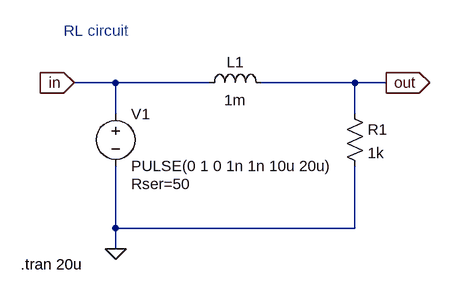
[diagram p0: schematic RL_circuit.asc]
RL_circuit.asc, the LTspice schematic file:
Version 4
SHEET 1 880 680
WIRE 64 96 0 96
WIRE 208 96 64 96
WIRE 432 96 288 96
WIRE 480 96 432 96
WIRE 64 144 64 96
WIRE 432 144 432 96
WIRE 64 320 64 224
WIRE 432 320 432 224
WIRE 432 320 64 320
WIRE 64 352 64 320
FLAG 0 96 in
IOPIN 0 96 In
FLAG 480 96 out
IOPIN 480 96 Out
FLAG 64 352 0
SYMBOL voltage 64 128 R0
WINDOW 123 0 0 Left 2
WINDOW 39 24 124 Left 2
SYMATTR InstName V1
SYMATTR Value PULSE(0 1 0 1n 1n 10u 20u)
SYMATTR SpiceLine Rser=50
SYMBOL ind 192 112 R270
WINDOW 0 32 56 VTop 2
WINDOW 3 5 56 VBottom 2
SYMATTR InstName L1
SYMATTR Value 1m
SYMBOL res 416 128 R0
SYMATTR InstName R1
SYMATTR Value 1k
TEXT -16 16 Left 2 ;RL circuit
TEXT -82 376 Left 2 !.tran 20u

The netlist it stands for:
* RL_circuit.asc
V1 in 0 PULSE(0 1 0 1n 1n 10u 20u) Rser=50
L1 in out 1m
R1 out 0 1k
* RL circuit
.tran 20u
.backanno
.end

* Results of the author's LTspice run, read from the files saved beside the schematic
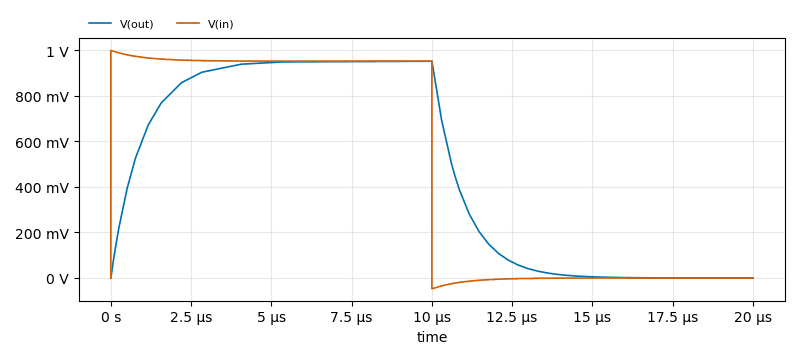
[diagram p1: Transient Analysis of RL_circuit.asc, plotted from the saved traces]
* Transient Analysis, 1 run:
*   V(out): min 0 V, max 952.4 mV, average 475.6 mV, rms 640.1 mV, last 26.26 µV
*   V(in): min -47.59 mV, max 1 V, average 476.3 mV, rms 676.8 mV, last -1.313 µV